# EAGLE design hanukkia (EAGLE 9.6.2)
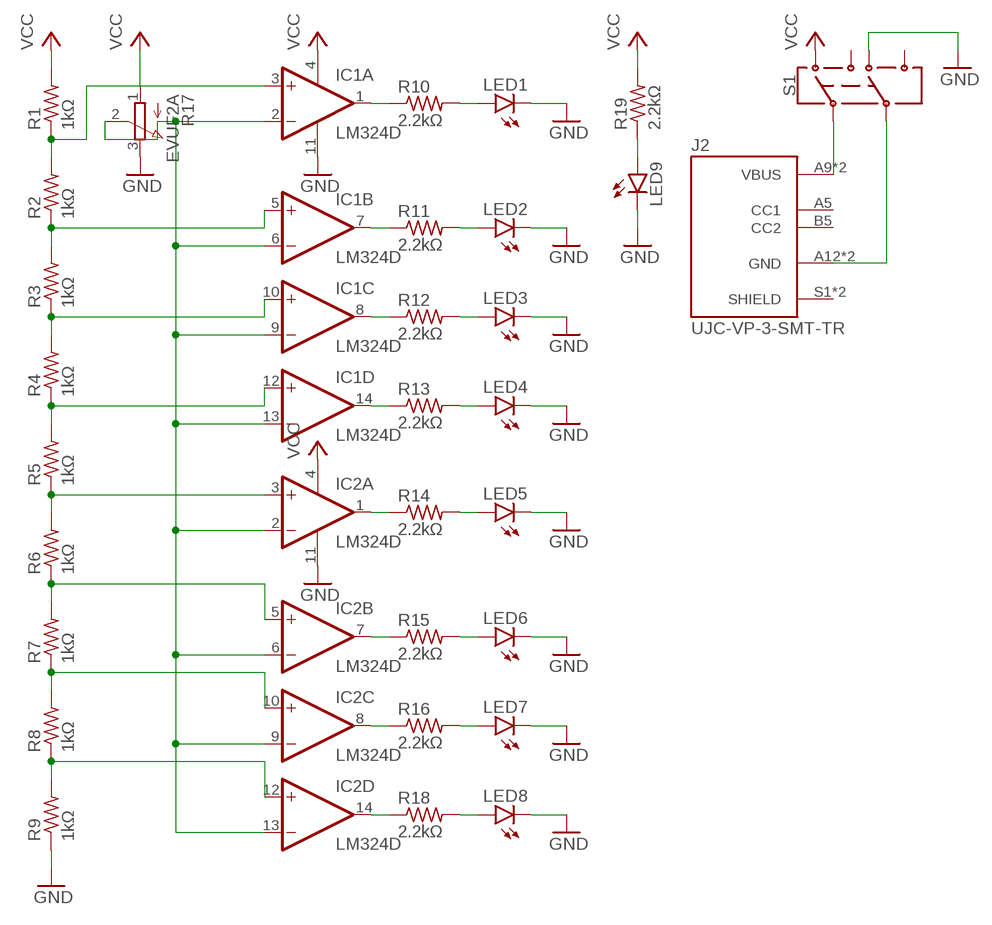
[diagram p0: schematic, sheet 1]

## Parts
IC1  LM324D  [SO14]
IC2  LM324D  [SO14]
J2  UJC-VP-3-SMT-TR  [CUI_UJC-VP-3-SMT-TR]
LED1  LEDCHIPLED_1206  [CHIPLED_1206]
LED2  LEDCHIPLED_1206  [CHIPLED_1206]
LED3  LEDCHIPLED_1206  [CHIPLED_1206]
LED4  LEDCHIPLED_1206  [CHIPLED_1206]
LED5  LEDCHIPLED_1206  [CHIPLED_1206]
LED6  LEDCHIPLED_1206  [CHIPLED_1206]
LED7  LEDCHIPLED_1206  [CHIPLED_1206]
LED8  LEDCHIPLED_1206  [CHIPLED_1206]
LED9  LEDCHIPLED_1206  [CHIPLED_1206]
R1  1kΩ  R-US_R1206  [R1206]
R2  1kΩ  R-US_R1206  [R1206]
R3  1kΩ  R-US_R1206  [R1206]
R4  1kΩ  R-US_R1206  [R1206]
R5  1kΩ  R-US_R1206  [R1206]
R6  1kΩ  R-US_R1206  [R1206]
R7  1kΩ  R-US_R1206  [R1206]
R8  1kΩ  R-US_R1206  [R1206]
R9  1kΩ  R-US_R1206  [R1206]
R10  2.2kΩ  R-US_R1206  [R1206]
R11  2.2kΩ  R-US_R1206  [R1206]
R12  2.2kΩ  R-US_R1206  [R1206]
R13  2.2kΩ  R-US_R1206  [R1206]
R14  2.2kΩ  R-US_R1206  [R1206]
R15  2.2kΩ  R-US_R1206  [R1206]
R16  2.2kΩ  R-US_R1206  [R1206]
R17  EVUF2A  [EVUF]
R18  2.2kΩ  R-US_R1206  [R1206]
R19  2.2kΩ  R-US_R1206  [R1206]
S1  SWITCH-DPDT-SMD-AYZ0202  [SWITCH_DPDT_SMD_AYZ0202]

## Nets
GND: IC1.11(P:V-) IC2.11(P:V-) LED1.C LED2.C LED3.C LED4.C LED5.C LED6.C LED7.C LED8.C LED9.C R9.1 R17.3(E) S1.6
N$1: IC1.3(A:+IN) R1.1 R2.2
N$2: IC1.5(B:+IN) R2.1 R3.2
N$3: IC1.10(C:+IN) R3.1 R4.2
N$4: IC1.12(D:+IN) R4.1 R5.2
N$5: IC2.3(A:+IN) R5.1 R6.2
N$6: IC2.5(B:+IN) R6.1 R7.2
N$7: IC2.10(C:+IN) R7.1 R8.2
N$8: IC2.12(D:+IN) R8.1 R9.2
N$9: IC1.2(A:-IN) IC1.6(B:-IN) IC1.9(C:-IN) IC1.13(D:-IN) IC2.2(A:-IN) IC2.6(B:-IN) IC2.9(C:-IN) IC2.13(D:-IN) R17.2(S)
N$10: IC1.1(A:OUT) R10.1
N$11: LED1.A R10.2
N$12: LED2.A R11.2
N$13: IC1.7(B:OUT) R11.1
N$14: IC1.8(C:OUT) R12.1
N$15: LED3.A R12.2
N$16: IC1.14(D:OUT) R13.1
N$17: LED4.A R13.2
N$18: IC2.1(A:OUT) R14.1
N$19: LED5.A R14.2
N$20: IC2.7(B:OUT) R15.1
N$21: LED6.A R15.2
N$22: IC2.8(C:OUT) R16.1
N$23: LED7.A R16.2
N$24: IC2.14(D:OUT) R18.1
N$25: LED8.A R18.2
N$26: LED9.A R19.1
N$27: J2.A9(VBUS) J2.B9(VBUS) S1.2
N$28: J2.A12(GND) J2.B12(GND) S1.5
VCC: IC1.4(P:V+) IC2.4(P:V+) R1.2 R17.1(A) R19.2 S1.3
Unconnected: J2.A5(CC1) J2.B5(CC2) J2.S1(SHIELD) J2.S2(SHIELD) S1.1 S1.4

## Library data of the parts
IC1 IC2 = linear:LM324: OP AMP
J2 = UJC-VP-3-SMT-TR:UJC-VP-3-SMT-TR; CHECK_PRICES: https://www.snapeda.com/parts/UJC-VP-3-SMT-TR/CUI+Devices/view-part/?ref=eda; CUI_PURCHASE_URL: https://www.cuidevices.com/product/interconnect/connectors/usb-connectors/ujc-vp-3-smt-tr?utm_source=snapeda.com&utm_medium=referral&utm_campaign=snapedaBOM; DESCRIPTION: Type C, 20 Vac, 3 A, Vertical, Surface Mount, Power-Only USB Receptacle; DIGIKEY_PART_NUMBER: 2223-UJC-VP-3-SMT-TR-ND; MF: CUI Devices; MP: UJC-VP-3-SMT-TR; PACKAGE: None; PURCHASE-URL: https://www.snapeda.com/api/url_track_click_mouser/?unipart_id=5887767&manufacturer=CUI Devices&part_name=UJC-VP-3-SMT-TR&search_term=None; SNAPEDA_LINK: https://www.snapeda.com/parts/UJC-VP-3-SMT-TR/CUI+Devices/view-part/?ref=snap
LED1-LED9 = led:LED: LED OSRAM: - CHIPLED LG R971, LG N971, LY N971, LG Q971, LY Q971, LO R971, LY R971 LH N974, LH R974 LS Q976, LO Q976, LY Q976 LO Q996 - Hyper CHIPLED LW Q18S LB Q993, LB Q99A, LB R99A - SideLED LS A670, LO A670, LY A670, LG A670, LP A670 LB A673, LV A673, LT A673, LW A673 LH A674 LY A675 LS A676, LA A676, LO A676, LY A676, LW A676 LS A679, LY A679, LG A679 - Hyper Micro SIDELED® LS Y876, LA Y876, LO Y876, LY Y876 LT Y87S - SmartLED LW L88C, LW L88S LB L89C, LB L89S, LG L890 LS L89K, LO L89K, LY L89K LS L896, LA L896, LO L896, LY L896 - TOPLED LS T670, LO T670, LY T670, LG T670, LP T670 LSG T670, LSP T670, LSY T670, LOP T670, LYG T670 LG T671, LOG T671, LSG T671 LB T673, LV T673, LT T673, LW T673 LH T674 LS T676, LA T676, LO T676, LY T676, LB T676, LH T676, LSB T676, LW T676 LB T67C, LV T67C, LT T67C, LS T67K, LO T67K, LY T67K, LW E67C LS E67B, LA E67B, LO E67B, LY E67B, LB E67C, LV E67C, LT E67C LW T67C LS T679, LY T679, LG T679 LS T770, LO T770, LY T770, LG T770, LP T770 LB T773, LV T773, LT T773, LW T773 LH T774 LS E675, LA E675, LY E675, LS T675 LS T776, LA T776, LO T776, LY T776, LB T776 LHGB T686 LT T68C, LB T68C - Hyper Mini TOPLED® LB M676 - Mini TOPLED Santana® LG M470 LS M47K, LO M47K, LY M47K Source: http://www.osram.convergy.de LUXEON: - LUMILED® LXK2-PW12-R00, LXK2-PW12-S00, LXK2-PW14-U00, LXK2-PW14-V00 LXK2-PM12-R00, LXK2-PM12-S00, LXK2-PM14-U00 LXK2-PE12-Q00, LXK2-PE12-R00, LXK2-PE12-S00, LXK2-PE14-T00, LXK2-PE14-U00 LXK2-PB12-K00, LXK2-PB12-L00, LXK2-PB12-M00, LXK2-PB14-N00, LXK2-PB14-P00, LXK2-PB14-Q00 LXK2-PR12-L00, LXK2-PR12-M00, LXK2-PR14-Q00, LXK2-PR14-R00 LXK2-PD12-Q00, LXK2-PD12-R00, LXK2-PD12-S00 LXK2-PH12-R00, LXK2-PH12-S00 LXK2-PL12-P00, LXK2-PL12-Q00, LXK2-PL12-R00 Source: www.luxeon.com KINGBRIGHT: KA-3528ASYC Source: www.kingbright.com
R1-R16 R18 R19 = rcl:R-US_: RESISTOR, American symbol; SPICEPREFIX: R
R17 = pot:EVU: 9 mm Square Rotary Potentiometers Source: Panasonic
S1 = SparkFun-Switches:SWITCH-DPDT: Double-Pole, Double-Throw (DPDT) Switch Double-pole, double-throw switches. Variant Overview PTH-GPI-152-3013 Used on SparkFun Geiger Counter <https://www.sparkfun.com/products/11345> SMD-AY0202 Surface Mount DPDT Switch <https://www.sparkfun.com/products/597> (COM-00597) Used on e.g. LilyPad Arduino USB - ATmega32U4 Board <https://www.sparkfun.com/products/12049>; PROD_ID: SWCH-08179; SF_SKU: COM-00597

## Board
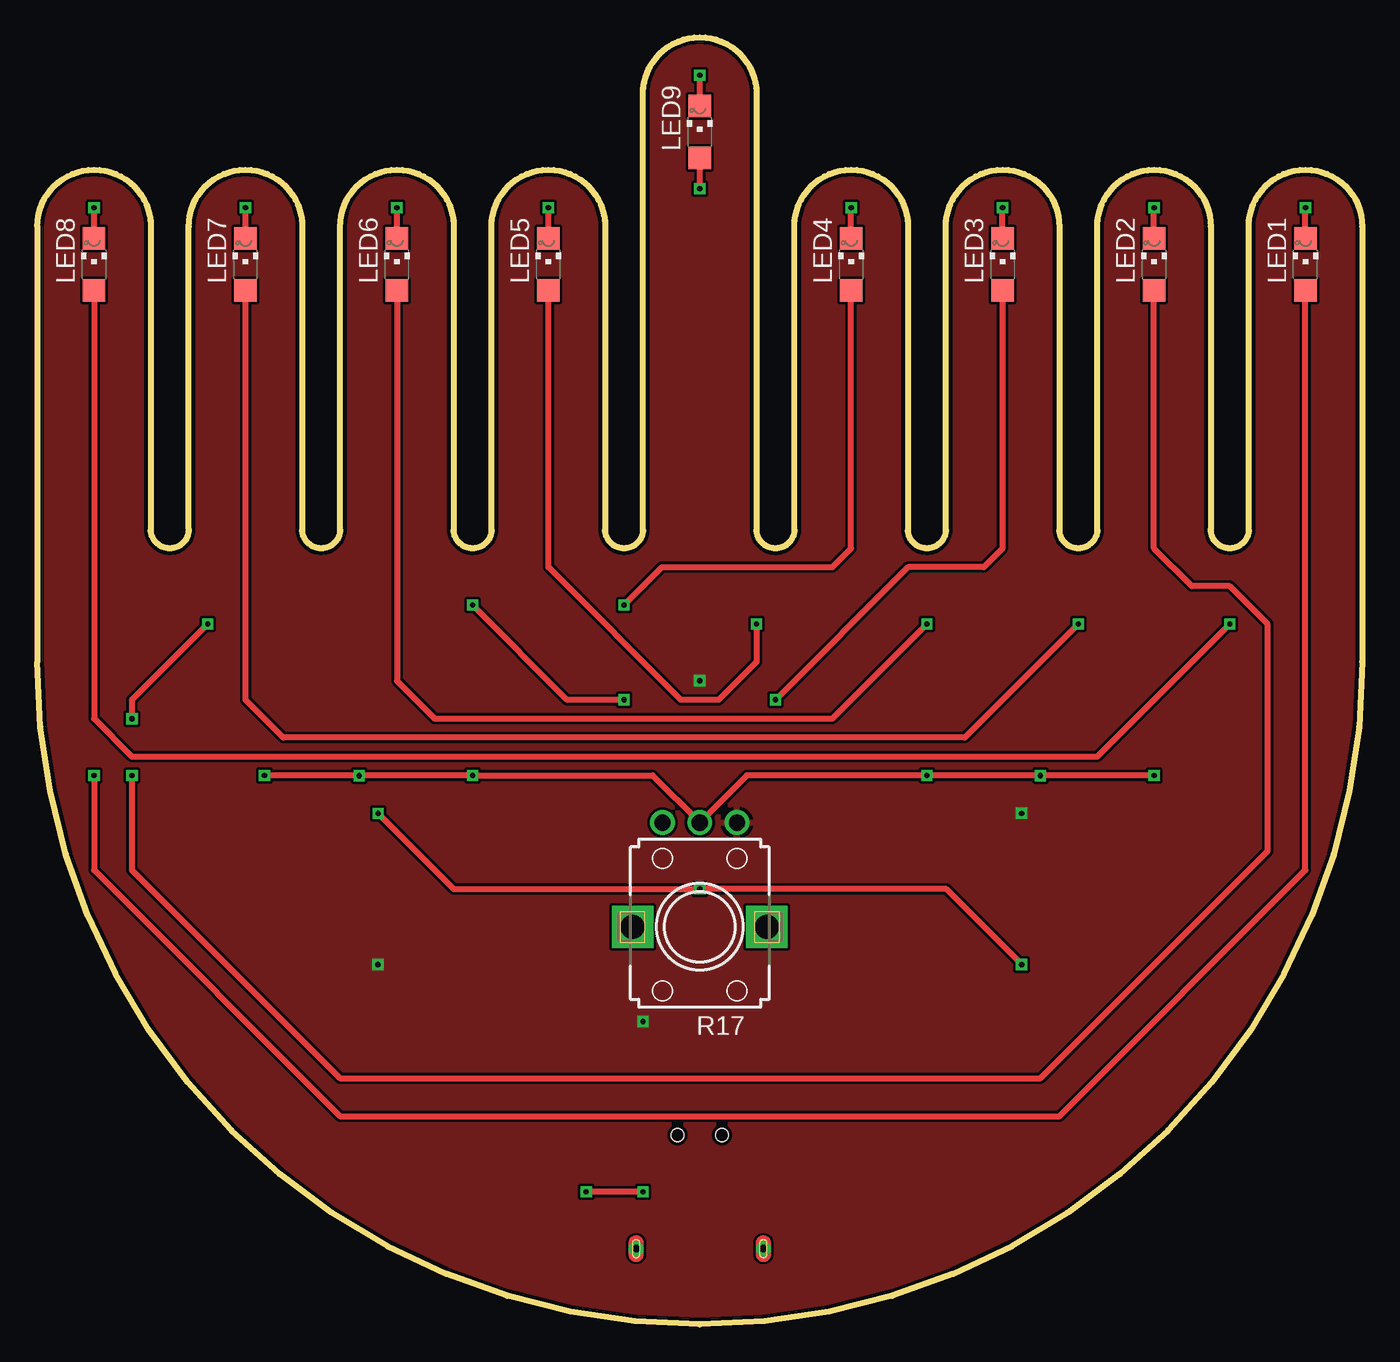
[diagram p1: board, top side]
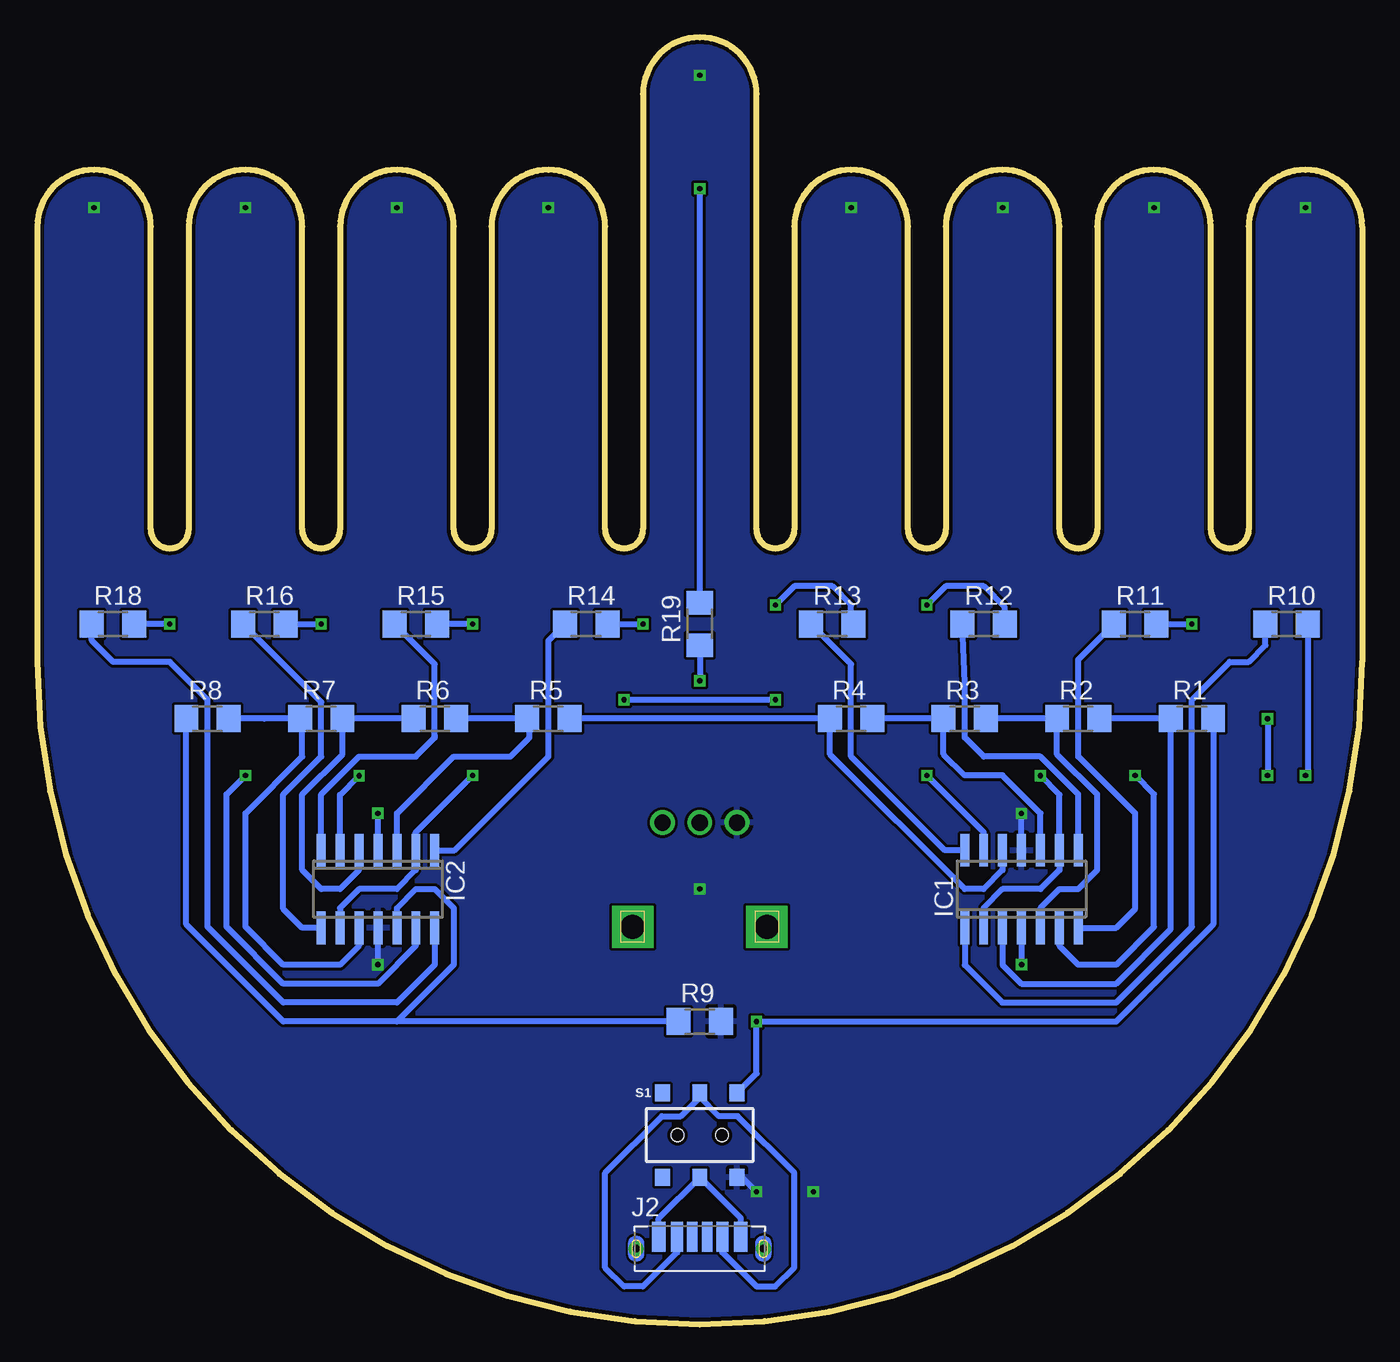
[diagram p2: board, bottom side, seen from below]

Size 88.9 x 86.36 mm. Coordinates in mm from the lower left corner, seen from the top.
Outline: 40.64,82.55 arc-180 48.26,82.55 48.26,53.34 arc180 50.8,53.34 50.8,73.66 arc-180 58.42,73.66 58.42,53.34 arc180 60.96,53.34 60.96,73.66 arc-180 68.58,73.66 68.58,53.34 arc180 71.12,53.34 71.12,73.66 arc-180 78.74,73.66 78.74,53.34 arc180 81.28,53.34 81.28,73.66 arc-180 88.9,73.66 88.9,44.45 arc-180 0,44.45 0,73.66 arc-180 7.62,73.66 7.62,53.34 arc180 10.16,53.34 10.16,73.66 arc-180 17.78,73.66 17.78,53.34 arc180 20.32,53.34 20.32,73.66 arc-180 27.94,73.66 27.94,53.34 arc180 30.48,53.34 30.48,73.66 arc-180 38.1,73.66 38.1,53.34 arc180 40.64,53.34 40.64,82.55
Copper layers (1*16): Top 0.0356mm / dielectric 1.5011mm / Bottom 0.0356mm
Design rules "PCBway": minimum track width 7mil, minimum drill 10mil, track to track 7mil, track to pad 7mil, pad to pad 7mil, via to via 7mil, smd to smd 0mil, copper to edge 10mil, drill to drill 10mil, minimum pad ring 4mil, minimum via ring 8mil, stop-mask expansion 4mil, vias tented up to drill 0mil, thermal gap 10mil

### Footprints (pad centres in the part's own frame; a part is rotated, then mirrored left to right if it is on the bottom)
SO14 = smd 0.6 x 2.2: 1 -3.81,-2.6; 2 -2.54,-2.6; 3 -1.27,-2.6; 4 0,-2.6; 5 1.27,-2.6; 6 2.54,-2.6; 7 3.81,-2.6; 8 3.81,2.6; 9 2.54,2.6; 10 1.27,2.6; 11 0,2.6; 12 -1.27,2.6; 13 -2.54,2.6; 14 -3.81,2.6
CUI_UJC-VP-3-SMT-TR = smd 0.7 x 2: A5 -0.5,0.8; B5 0.5,0.8 | smd 0.8 x 2: A9 -1.52,0.8; B9 1.52,0.8 | smd 0.9 x 2: A12 -2.75,0.8; B12 2.75,0.8 | drill 0.5 pad 1: S1 -4.27,0; S2 4.27,0
CHIPLED_1206 = smd 1.5 x 1.5: A 0,-1.75; C 0,1.75
R1206 = smd 1.6 x 1.803: 1 -1.422,0; 2 1.422,0
EVUF = drill 1.1 pad 1.676: 1 -2.5,-7; 2 0,-7; 3 2.5,-7 | drill 1.6 pad 2.8 square: M1 4.5,0; M2 -4.5,0
SWITCH_DPDT_SMD_AYZ0202 = smd 1 x 1.15: 1 -2.5,2.825; 2 0,2.825; 3 2.5,2.825; 4 -2.5,-2.825; 5 0,-2.825; 6 2.5,-2.825 | hole 0.85: 1.5,0; -1.5,0

### Placement (x,y rotation side)
IC1  22.86,29.21 0 bottom
IC2  66.04,29.21 180 bottom
J2  44.45,5.08 0 bottom
LED1  85.09,71.12 0 top
LED2  74.93,71.12 0 top
LED3  64.77,71.12 0 top
LED4  54.61,71.12 0 top
LED5  34.29,71.12 0 top
LED6  24.13,71.12 0 top
LED7  13.97,71.12 0 top
LED8  3.81,71.12 0 top
LED9  44.45,80.01 0 top
R1  11.43,40.64 0 bottom
R2  19.05,40.64 0 bottom
R3  26.67,40.64 0 bottom
R4  34.29,40.64 0 bottom
R5  54.61,40.64 0 bottom
R6  62.23,40.64 0 bottom
R7  69.85,40.64 0 bottom
R8  77.47,40.64 0 bottom
R9  44.45,20.32 180 bottom
R10  5.08,46.99 0 bottom
R11  15.24,46.99 0 bottom
R12  25.4,46.99 0 bottom
R13  35.56,46.99 0 bottom
R14  52.07,46.99 0 bottom
R15  63.5,46.99 0 bottom
R16  73.66,46.99 0 bottom
R17  44.45,26.67 180 top
R18  83.82,46.99 0 bottom
R19  44.45,46.99 270 bottom
S1  44.45,12.7 0 bottom

### Tracks (layer width: path | path; a pad name or v marks a point on that pad's centre or on a via)
GND  (via drill 0.35)
  Top 0.406: v40.64,8.89 v36.83,8.89 | LED1.C v85.09,74.93 | LED2.C v74.93,74.93 | LED3.C v64.77,74.93 | LED4.C v54.61,74.93 | LED9.C v44.45,83.82 | LED5.C v34.29,74.93 | LED6.C v24.13,74.93 | LED7.C v13.97,74.93 | LED8.C v3.81,74.93 | v22.87,34.28 27.94,29.21 v44.45,29.21 60.98,29.21 v66.05,24.14
  Bottom 0.406: S1.6 41.62,9.88 v40.64,8.89 | IC1.11 22.86,34.27 v22.87,34.28 | v66.05,24.14 66.04,24.16 IC2.11
  pour Bottom: 0,73.66 0,44.45 arc180 88.9,44.45 88.9,73.66 arc180 81.28,73.66 81.28,53.34 arc-180 78.74,53.34 78.74,73.66 arc180 71.12,73.66 71.12,53.34 arc-180 68.58,53.34 68.58,73.66 arc180 60.96,73.66 60.96,53.34 arc-180 58.42,53.34 58.42,73.66 arc180 50.8,73.66 50.8,53.34 arc-180 48.26,53.34 48.26,82.55 arc180 40.64,82.55 40.64,53.34 arc-180 38.1,53.34 38.1,73.66 arc180 30.48,73.66 30.48,53.34 arc-180 27.94,53.34 27.94,73.66 arc180 20.32,73.66 20.32,53.34 arc-180 17.78,53.34 17.78,73.66 arc180 10.16,73.66 10.16,53.34 arc-180 7.62,53.34 7.62,73.66 arc180
N$1
  Bottom 0.406: R2.2 R1.1 12.85,26.52 16.51,22.86 22.86,22.86 24.13,24.13 IC1.3
N$2
  Bottom 0.406: R3.2 R2.1 20.47,38.25 17.78,35.56 17.78,30.48 19.05,29.21 20.32,29.21 21.59,27.94 IC1.5
N$3
  Bottom 0.406: R4.2 R3.1 28.09,38.25 26.67,36.83 24.13,36.83 21.59,34.29 IC1.10
N$4
  Bottom 0.406: R5.2 R4.1 35.71,38.25 26.67,29.21 25.4,29.21 24.13,30.48 IC1.12
N$5
  Bottom 0.406: R6.2 R5.1 55.88,40.49 55.88,39.37 57.15,38.1 60.96,38.1 64.77,34.29 IC2.3
N$6
  Bottom 0.406: R6.1 R7.2 68.43,38.25 71.12,35.56 71.12,30.48 69.85,29.21 68.58,29.21 67.31,30.48 IC2.5
N$7
  Bottom 0.406: R8.2 73.66,40.64 R7.1 71.12,40.49 71.12,38.1 74.93,34.29 74.93,26.67 72.39,24.13 68.58,24.13 67.31,25.4 IC2.10
N$8
  Bottom 0.406: R9.2 64.77,20.32 | 64.77,20.32 72.39,20.32 78.89,26.82 R8.1 | IC2.12 64.77,27.94 63.5,29.21 62.23,29.21 60.96,27.94 60.96,24.13 64.77,20.32
N$9  (via drill 0.35)
  Top 0.406: v15.24,36.83 15.25,36.82 v21.6,36.82 29.2,36.82 v29.21,36.83 41.29,36.83 R17.2 47.61,36.83 v59.69,36.83 59.7,36.82 v67.3,36.82 v67.31,36.83 v74.93,36.83
  Bottom 0.406: IC1.2 25.4,27.94 24.13,29.21 21.59,29.21 20.32,30.48 IC1.9 20.32,35.53 v21.6,36.82 | IC1.6 20.32,25.4 19.05,24.13 16.51,24.13 13.97,26.67 13.97,35.56 v15.24,36.83 | IC2.9 68.58,27.94 67.31,29.21 64.77,29.21 63.5,30.48 IC2.2 63.5,33.02 v59.69,36.83 | IC1.13 25.4,33.02 v29.21,36.83 | v67.3,36.82 68.58,35.53 IC2.6 | IC2.13 63.5,25.4 66.04,22.86 72.39,22.86 76.2,26.67 76.2,35.56 v74.93,36.83
N$10
  Bottom 0.406: IC1.1 26.67,24.11 24.16,21.59 16.51,21.59 11.43,26.67 11.43,41.91 8.89,44.45 7.62,44.45 6.5,45.57 R10.1
N$11  (via drill 0.35)
  Top 0.406: v3.81,36.83 3.81,30.48 20.32,13.97 68.58,13.97 85.09,30.48 LED1.A
  Bottom 0.406: R10.2 3.66,36.98 v3.81,36.83
N$12  (via drill 0.35)
  Top 0.406: LED2.A 74.93,52.07 77.47,49.53 80.01,49.53 82.55,46.99 82.55,31.75 67.31,16.51 20.32,16.51 6.35,30.48 v6.35,36.83 | v11.43,46.99 6.35,41.91 v6.35,40.64
  Bottom 0.406: R11.2 v11.43,46.99 | v6.35,40.64 v6.35,36.83
N$13
  Bottom 0.406: IC1.7 16.51,26.61 15.24,27.88 15.24,34.29 19.05,38.1 19.05,44.6 R11.1
N$14
  Bottom 0.406: IC1.8 19.05,35.56 21.59,38.1 25.4,38.1 26.67,39.37 26.67,43.03 R12.1
N$15  (via drill 0.35)
  Top 0.406: LED3.A 64.77,52.07 63.5,50.8 58.42,50.8 v49.53,41.91 | v39.37,41.91 35.56,41.91 v29.21,48.26
  Bottom 0.406: R12.2 23.98,48.11 25.4,49.53 27.94,49.53 v29.21,48.26 | v39.37,41.91 v49.53,41.91
N$16
  Bottom 0.406: IC1.14 28,31.81 34.29,38.1 34.29,44.3 R13.1
N$17  (via drill 0.35)
  Top 0.406: LED4.A 54.61,52.07 53.34,50.8 41.91,50.8 v39.37,48.26
  Bottom 0.406: R13.2 34.29,47.14 34.29,48.26 35.56,49.53 38.1,49.53 v39.37,48.26
N$18
  Bottom 0.406: IC2.1 60.9,31.81 54.61,38.1 54.61,45.87 R14.1
N$19  (via drill 0.35)
  Top 0.406: v48.26,46.99 48.26,44.45 45.72,41.91 43.18,41.91 34.29,50.8 LED5.A
  Bottom 0.406: R14.2 v48.26,46.99
N$20
  Bottom 0.406: IC2.7 69.85,35.56 67.31,38.1 63.5,38.1 62.23,39.37 62.23,39.49 62.23,44.3 R15.1
N$21  (via drill 0.35)
  Top 0.406: LED6.A 24.13,43.18 26.67,40.64 53.34,40.64 v59.69,46.99
  Bottom 0.406: v59.69,46.99 R15.2
N$22
  Bottom 0.406: IC2.8 71.12,26.61 72.39,27.88 72.39,35.56 69.85,38.1 69.85,41.76 R16.1
N$23  (via drill 0.35)
  Top 0.406: v69.85,46.99 62.23,39.37 16.51,39.37 13.97,41.91 LED7.A
  Bottom 0.406: R16.2 v69.85,46.99
N$24
  Bottom 0.406: IC2.14 62.23,24.13 64.77,21.59 72.39,21.59 77.47,26.67 77.47,41.91 80.01,44.45 83.82,44.45 85.24,45.87 R18.1
N$25  (via drill 0.35)
  Top 0.406: LED8.A 3.81,40.64 6.35,38.1 71.12,38.1 v80.01,46.99
  Bottom 0.406: v80.01,46.99 R18.2
N$26  (via drill 0.35)
  Top 0.406: v44.45,76.2 LED9.A
  Bottom 0.406: R19.1 v44.45,76.2
N$27
  Bottom 0.406: J2.B9 42.93,4.83 40.64,2.54 39.37,2.54 38.1,3.81 38.1,10.16 41.91,13.97 43.18,13.97 44.45,15.24 | 44.45,15.24 S1.2 | J2.A9 45.97,4.83 48.26,2.54 49.53,2.54 50.8,3.81 50.8,10.16 46.99,13.97 45.72,13.97 44.45,15.24
N$28
  Bottom 0.406: J2.B12 41.7,7.12 S1.5 47.2,7.12 J2.A12
VCC  (via drill 0.35)
  Bottom 0.406: R19.2 v44.45,43.18 | IC1.4 22.86,24.16 v22.85,24.14 | R1.2 10.01,26.82 16.51,20.32 v40.64,20.32 40.64,16.84 S1.3 | IC2.4 v66.04,34.29
  pour Top: 0,73.66 0,44.45 arc180 88.9,44.45 88.9,73.66 arc180 81.28,73.66 81.28,53.34 arc-180 78.74,53.34 78.74,73.66 arc180 71.12,73.66 71.12,53.34 arc-180 68.58,53.34 68.58,73.66 arc180 60.96,73.66 60.96,53.34 arc-180 58.42,53.34 58.42,73.66 arc180 50.8,73.66 50.8,53.34 arc-180 48.26,53.34 48.26,82.55 arc180 40.64,82.55 40.64,53.34 arc-180 38.1,53.34 38.1,73.66 arc180 30.48,73.66 30.48,53.34 arc-180 27.94,53.34 27.94,73.66 arc180 20.32,73.66 20.32,53.34 arc-180 17.78,53.34 17.78,73.66 arc180 10.16,73.66 10.16,53.34 arc-180 7.62,53.34 7.62,73.66 arc180

### Text on the board
bValues: ON | OFF